# Vivado block design top_level, xcu55c-fsvh2892-2L-e, Vivado 2024.2
# (continued, part 2 of 3)
current_bd_instance /channel_1/packet_buffer/data_buffer/channel_0
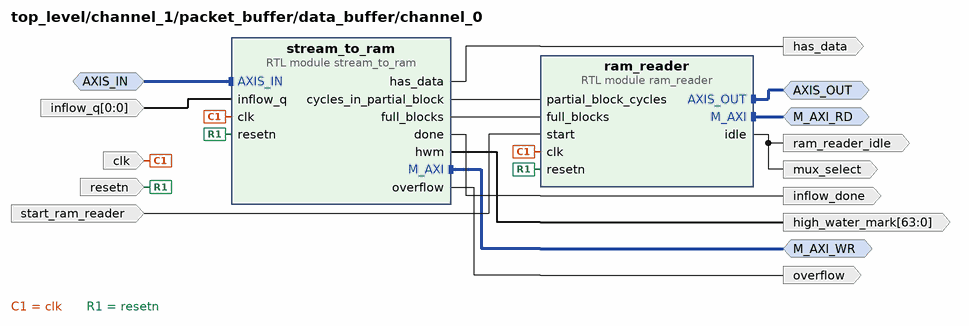
[diagram p24: block diagram inside /channel_1/packet_buffer/data_buffer/channel_0]
create_bd_intf_pin -mode Slave -vlnv xilinx.com:interface:axis_rtl:1.0 AXIS_IN
create_bd_intf_pin -mode Master -vlnv xilinx.com:interface:axis_rtl:1.0 AXIS_OUT
create_bd_intf_pin -mode Master -vlnv xilinx.com:interface:aximm_rtl:1.0 M_AXI_WR
create_bd_intf_pin -mode Master -vlnv xilinx.com:interface:aximm_rtl:1.0 M_AXI_RD
create_bd_pin -dir I -type clk clk
create_bd_pin -dir I resetn
create_bd_pin -dir I -from 0 -to 0 inflow_q
create_bd_pin -dir O ram_reader_idle
create_bd_pin -dir I start_ram_reader
create_bd_pin -dir O has_data
create_bd_pin -dir O inflow_done
create_bd_pin -dir O -from 63 -to 0 high_water_mark
create_bd_pin -dir O overflow
create_bd_pin -dir O mux_select

create_bd_cell -type module -reference stream_to_ram stream_to_ram
create_bd_cell -type module -reference ram_reader ram_reader

# ---- hierarchy /channel_1/packet_buffer/data_buffer/channel_1 ----
current_bd_instance /channel_1/packet_buffer/data_buffer/channel_1
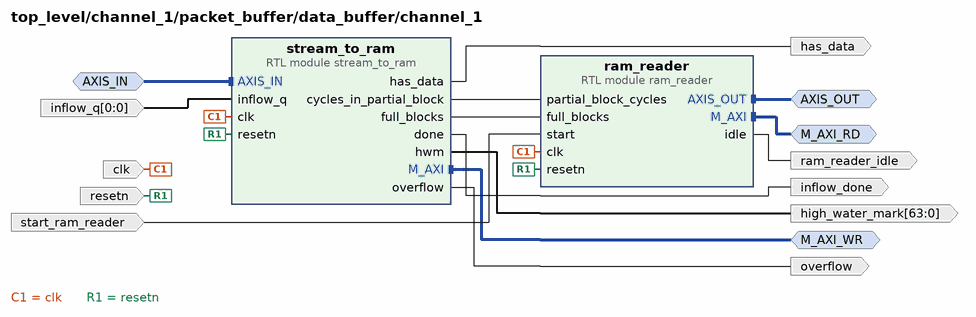
[diagram p25: block diagram inside /channel_1/packet_buffer/data_buffer/channel_1]
create_bd_intf_pin -mode Slave -vlnv xilinx.com:interface:axis_rtl:1.0 AXIS_IN
create_bd_intf_pin -mode Master -vlnv xilinx.com:interface:aximm_rtl:1.0 M_AXI_WR
create_bd_intf_pin -mode Master -vlnv xilinx.com:interface:axis_rtl:1.0 AXIS_OUT
create_bd_intf_pin -mode Master -vlnv xilinx.com:interface:aximm_rtl:1.0 M_AXI_RD
create_bd_pin -dir I -type clk clk
create_bd_pin -dir I resetn
create_bd_pin -dir I -from 0 -to 0 inflow_q
create_bd_pin -dir O has_data
create_bd_pin -dir O inflow_done
create_bd_pin -dir O -from 63 -to 0 high_water_mark
create_bd_pin -dir O overflow
create_bd_pin -dir O ram_reader_idle
create_bd_pin -dir I start_ram_reader

create_bd_cell -type module -reference stream_to_ram stream_to_ram
set_property -dict {CONFIG.CHANNEL 1} [get_bd_cells stream_to_ram]
create_bd_cell -type module -reference ram_reader ram_reader

# ---- hierarchy /channel_1/qsfp ----
current_bd_instance /channel_1/qsfp
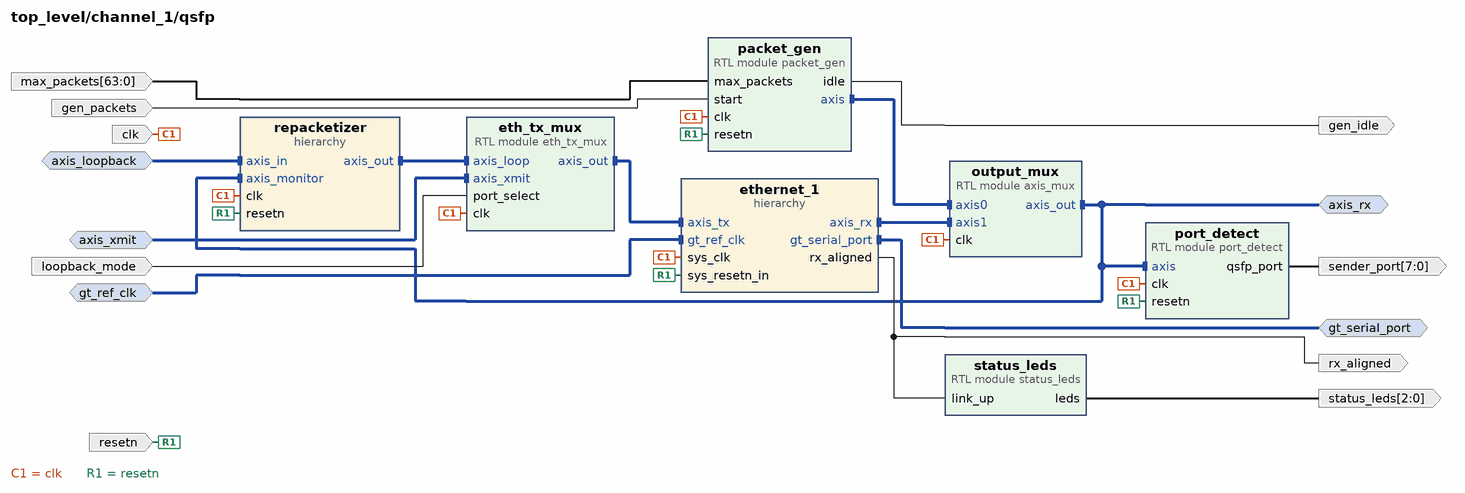
[diagram p26: block diagram inside /channel_1/qsfp]
create_bd_intf_pin -mode Master -vlnv xilinx.com:interface:axis_rtl:1.0 axis_rx
create_bd_intf_pin -mode Slave -vlnv xilinx.com:interface:diff_clock_rtl:1.0 gt_ref_clk
create_bd_intf_pin -mode Master -vlnv xilinx.com:interface:gt_rtl:1.0 gt_serial_port
create_bd_intf_pin -mode Slave -vlnv xilinx.com:interface:axis_rtl:1.0 axis_loopback
create_bd_intf_pin -mode Slave -vlnv xilinx.com:interface:axis_rtl:1.0 axis_xmit
create_bd_pin -dir I -type clk clk
create_bd_pin -dir I -type rst resetn
create_bd_pin -dir I gen_packets
create_bd_pin -dir I -from 63 -to 0 max_packets
create_bd_pin -dir O gen_idle
create_bd_pin -dir O rx_aligned
create_bd_pin -dir I loopback_mode
create_bd_pin -dir O -from 2 -to 0 status_leds
create_bd_pin -dir O -from 7 -to 0 sender_port

create_bd_cell -type hier ethernet_1
create_bd_cell -type hier repacketizer
create_bd_cell -type module -reference axis_mux output_mux
create_bd_cell -type module -reference eth_tx_mux eth_tx_mux
create_bd_cell -type module -reference packet_gen packet_gen
set_property -dict {CONFIG.SRC_MAC 1} [get_bd_cells packet_gen]
create_bd_cell -type module -reference status_leds status_leds
create_bd_cell -type module -reference port_detect port_detect

# ---- hierarchy /channel_1/qsfp/ethernet_1 ----
current_bd_instance /channel_1/qsfp/ethernet_1
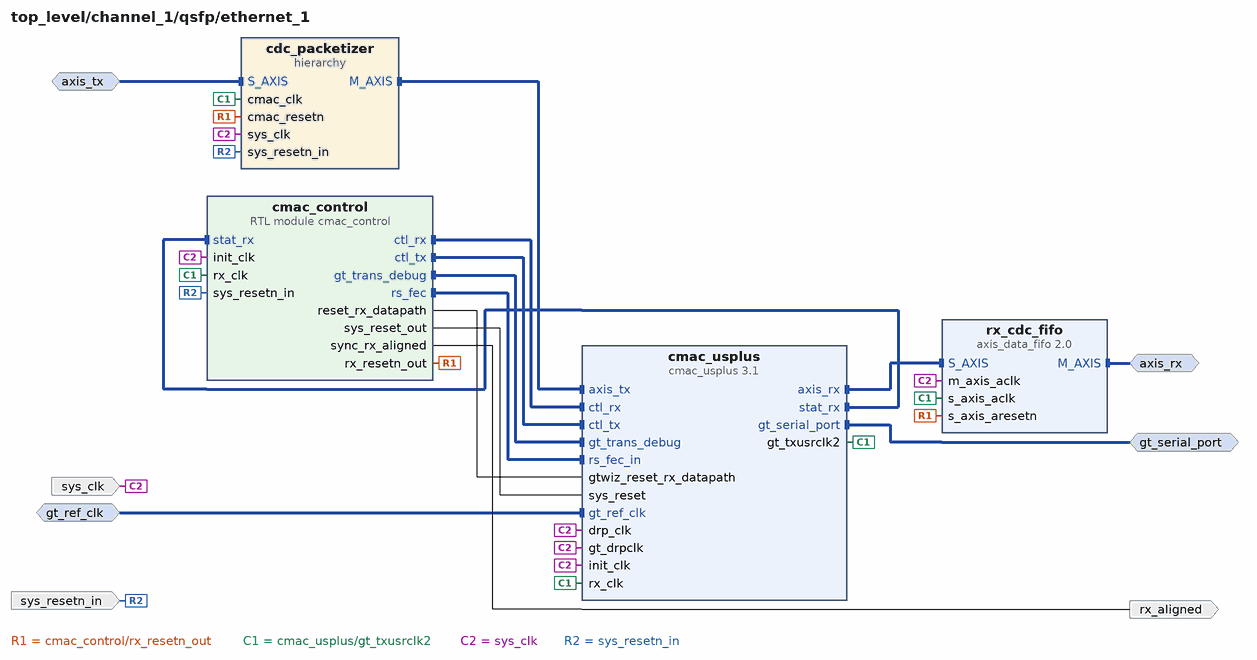
[diagram p27: block diagram inside /channel_1/qsfp/ethernet_1]
create_bd_intf_pin -mode Master -vlnv xilinx.com:interface:gt_rtl:1.0 gt_serial_port
create_bd_intf_pin -mode Slave -vlnv xilinx.com:interface:diff_clock_rtl:1.0 gt_ref_clk
create_bd_intf_pin -mode Master -vlnv xilinx.com:interface:axis_rtl:1.0 axis_rx
create_bd_intf_pin -mode Slave -vlnv xilinx.com:interface:axis_rtl:1.0 axis_tx
create_bd_pin -dir O rx_aligned
create_bd_pin -dir I sys_resetn_in
create_bd_pin -dir I sys_clk

create_bd_cell -type hier cdc_packetizer
create_bd_cell -type ip -vlnv xilinx.com:ip:axis_data_fifo:2.0 rx_cdc_fifo
set_property -dict {CONFIG.FIFO_DEPTH 16 CONFIG.IS_ACLK_ASYNC 1} [get_bd_cells rx_cdc_fifo]
create_bd_cell -type module -reference cmac_control cmac_control
create_bd_cell -type ip -vlnv xilinx.com:ip:cmac_usplus:3.1 cmac_usplus
set_property -dict [list \
  CONFIG.ADD_GT_CNRL_STS_PORTS 1 \
  CONFIG.CMAC_CAUI4_MODE 1 \
  CONFIG.CMAC_CORE_SELECT CMACE4_X0Y4 \
  CONFIG.GT_DRP_CLK 250 \
  CONFIG.GT_GROUP_SELECT {X0Y28~X0Y31} \
  CONFIG.GT_REF_CLK_FREQ 161.1328125 \
  CONFIG.INCLUDE_RS_FEC 1 \
  CONFIG.NUM_LANES 4x25 \
  CONFIG.RX_FLOW_CONTROL 0 \
  CONFIG.TX_FLOW_CONTROL 0 \
  CONFIG.USER_INTERFACE AXIS \
] [get_bd_cells cmac_usplus]

# ---- hierarchy /channel_1/qsfp/ethernet_1/cdc_packetizer ----
current_bd_instance /channel_1/qsfp/ethernet_1/cdc_packetizer
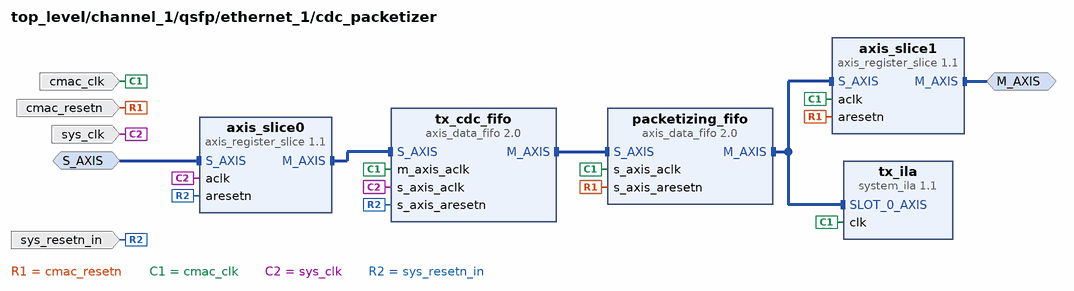
[diagram p28: block diagram inside /channel_1/qsfp/ethernet_1/cdc_packetizer]
create_bd_intf_pin -mode Slave -vlnv xilinx.com:interface:axis_rtl:1.0 S_AXIS
create_bd_intf_pin -mode Master -vlnv xilinx.com:interface:axis_rtl:1.0 M_AXIS
create_bd_pin -dir I sys_resetn_in
create_bd_pin -dir I sys_clk
create_bd_pin -dir I -type clk cmac_clk
create_bd_pin -dir I -type rst cmac_resetn

create_bd_cell -type ip -vlnv xilinx.com:ip:axis_data_fifo:2.0 tx_cdc_fifo
set_property -dict {CONFIG.FIFO_DEPTH 16 CONFIG.IS_ACLK_ASYNC 1} [get_bd_cells tx_cdc_fifo]
create_bd_cell -type ip -vlnv xilinx.com:ip:system_ila:1.1 tx_ila
set_property -dict {CONFIG.C_MON_TYPE INTERFACE CONFIG.C_SLOT_0_INTF_TYPE xilinx.com:interface:axis_rtl:1.0} [get_bd_cells tx_ila]
create_bd_cell -type ip -vlnv xilinx.com:ip:axis_data_fifo:2.0 packetizing_fifo
set_property -dict {CONFIG.FIFO_DEPTH 256 CONFIG.FIFO_MODE 2 CONFIG.IS_ACLK_ASYNC 0} [get_bd_cells packetizing_fifo]
create_bd_cell -type ip -vlnv xilinx.com:ip:axis_register_slice:1.1 axis_slice0
set_property -dict {CONFIG.REG_CONFIG 8} [get_bd_cells axis_slice0]
create_bd_cell -type ip -vlnv xilinx.com:ip:axis_register_slice:1.1 axis_slice1
set_property -dict {CONFIG.REG_CONFIG 8} [get_bd_cells axis_slice1]

# ---- hierarchy /channel_1/qsfp/repacketizer ----
current_bd_instance /channel_1/qsfp/repacketizer
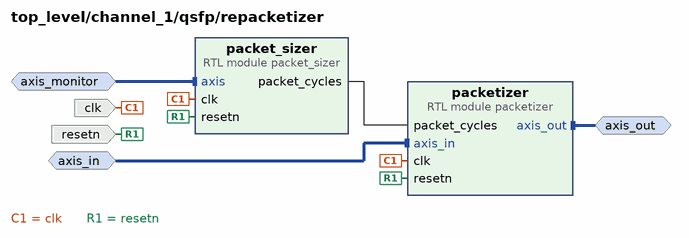
[diagram p29: block diagram inside /channel_1/qsfp/repacketizer]
create_bd_intf_pin -mode Monitor -vlnv xilinx.com:interface:axis_rtl:1.0 axis_monitor
create_bd_intf_pin -mode Slave -vlnv xilinx.com:interface:axis_rtl:1.0 axis_in
create_bd_intf_pin -mode Master -vlnv xilinx.com:interface:axis_rtl:1.0 axis_out
create_bd_pin -dir I -type clk clk
create_bd_pin -dir I -type rst resetn

create_bd_cell -type module -reference packet_sizer packet_sizer
create_bd_cell -type module -reference packetizer packetizer

# ---- connections ----

current_bd_instance /pcie0_bridge
connect_bd_intf_net [get_bd_intf_pins AXIS_RDMX] [get_bd_intf_pins axis_register_slice/S_AXIS]
connect_bd_intf_net [get_bd_intf_pins pcie_refclk] [get_bd_intf_pins bridge/pcie0_refclk]
connect_bd_intf_net [get_bd_intf_pins S_AXI_ABM] [get_bd_intf_pins axi_crossbar/S01_AXI]
connect_bd_intf_net [get_bd_intf_pins axi_crossbar/M00_AXI] [get_bd_intf_pins bridge/S_AXI_B]
connect_bd_intf_net [get_bd_intf_pins axi_crossbar/M00_AXI] [get_bd_intf_pins system_ila/SLOT_1_AXI]
connect_bd_intf_net [get_bd_intf_pins axis_register_slice/M_AXIS] [get_bd_intf_pins axis_throttle/axis_in]
connect_bd_intf_net [get_bd_intf_pins axis_throttle/axis_out] [get_bd_intf_pins rdmx_to_pci/AXIS_IN]
connect_bd_intf_net [get_bd_intf_pins axis_throttle/axis_out] [get_bd_intf_pins system_ila/SLOT_0_AXIS]
connect_bd_intf_net [get_bd_intf_pins M_AXI_B] [get_bd_intf_pins bridge/M_AXI_B]
connect_bd_intf_net [get_bd_intf_pins pcie_mgt] [get_bd_intf_pins bridge/pcie0_mgt]
connect_bd_intf_net [get_bd_intf_pins rdmx_to_pci/M_AXI] [get_bd_intf_pins axi_crossbar/S00_AXI]
connect_bd_net -net pause_1 [get_bd_pins pause_pci] [get_bd_pins axis_throttle/pause]
connect_bd_net [get_bd_pins pci_base] [get_bd_pins rdmx_to_pci/pci_base]
connect_bd_net [get_bd_pins pci_size] [get_bd_pins rdmx_to_pci/pci_size]
connect_bd_net -net pcie_bridge_axi_aclk [get_bd_pins bridge/axi_aclk] \
  [get_bd_pins axi_aclk] [get_bd_pins axis_throttle/clk] [get_bd_pins axis_register_slice/aclk] [get_bd_pins system_ila/clk] \
  [get_bd_pins axi_crossbar/aclk] [get_bd_pins rdmx_to_pci/axi_aclk]
connect_bd_net -net pcie_bridge_axi_aresetn [get_bd_pins bridge/axi_aresetn] [get_bd_pins axi_aresetn]
connect_bd_net -net rdmx_to_pci_pci_range_err [get_bd_pins rdmx_to_pci/pci_range_err_strb] [get_bd_pins pci_range_err_strb]
connect_bd_net [get_bd_pins rdmx_to_pci/pci_throughput] [get_bd_pins pci_throughput]
connect_bd_net [get_bd_pins resetn_in] \
  [get_bd_pins axis_register_slice/aresetn] [get_bd_pins axi_crossbar/aresetn] [get_bd_pins rdmx_to_pci/resetn_in]
connect_bd_net -net sys_rst_n_1 [get_bd_pins pcie_sys_rst_n] [get_bd_pins bridge/sys_rst_n]

current_bd_instance /pcie0_bridge/bridge
connect_bd_intf_net [get_bd_intf_pins pcie0_refclk] [get_bd_intf_pins util_ds_buf/CLK_IN_D]
connect_bd_intf_net [get_bd_intf_pins axi4_lite_plug/M_AXI] [get_bd_intf_pins pcie_bridge/S_AXI_LITE]
connect_bd_intf_net [get_bd_intf_pins S_AXI_B] [get_bd_intf_pins pcie_bridge/S_AXI_B]
connect_bd_intf_net [get_bd_intf_pins M_AXI_B] [get_bd_intf_pins pcie_bridge/M_AXI_B]
connect_bd_intf_net [get_bd_intf_pins pcie0_mgt] [get_bd_intf_pins pcie_bridge/pcie_mgt]
connect_bd_net [get_bd_pins pcie_bridge/axi_aclk] [get_bd_pins axi_aclk] [get_bd_pins axi4_lite_plug/clk]
connect_bd_net [get_bd_pins pcie_bridge/axi_aresetn] [get_bd_pins axi_aresetn]
connect_bd_net [get_bd_pins sys_rst_n] [get_bd_pins pcie_bridge/sys_rst_n]
connect_bd_net [get_bd_pins util_ds_buf/IBUF_DS_ODIV2] [get_bd_pins pcie_bridge/sys_clk]
connect_bd_net [get_bd_pins util_ds_buf/IBUF_OUT] [get_bd_pins pcie_bridge/sys_clk_gt]

current_bd_instance /pcie0_bridge/rdmx_to_pci
connect_bd_intf_net [get_bd_intf_pins M_AXI] [get_bd_intf_pins axi4_memfence/DST_AXI]
connect_bd_intf_net [get_bd_intf_pins AXIS_IN] [get_bd_intf_pins rdmx_to_pci/AXIS_IN]
connect_bd_intf_net [get_bd_intf_pins rdmx_to_pci/M_AXI] [get_bd_intf_pins axi4_memfence/SRC_AXI]
connect_bd_net [get_bd_pins pci_base] [get_bd_pins rdmx_to_pci/pci_base]
connect_bd_net [get_bd_pins pci_size] [get_bd_pins rdmx_to_pci/pci_size]
connect_bd_net -net pcie_bridge_axi_aclk [get_bd_pins axi_aclk] [get_bd_pins axi4_memfence/clk] [get_bd_pins rdmx_to_pci/clk]
connect_bd_net -net rdmx_to_pci_pci_range_err [get_bd_pins rdmx_to_pci/pci_range_err_strb] [get_bd_pins pci_range_err_strb]
connect_bd_net [get_bd_pins rdmx_to_pci/pci_throughput] [get_bd_pins pci_throughput]
connect_bd_net [get_bd_pins resetn_in] [get_bd_pins axi4_memfence/resetn] [get_bd_pins rdmx_to_pci/resetn]

current_bd_instance /system_interconnect
connect_bd_intf_net [get_bd_intf_pins S00_AXI] [get_bd_intf_pins system_interconnect/S00_AXI]
connect_bd_intf_net [get_bd_intf_pins M00_AXI] [get_bd_intf_pins system_interconnect/M00_AXI]
connect_bd_intf_net [get_bd_intf_pins M01_AXI] [get_bd_intf_pins system_interconnect/M01_AXI]
connect_bd_intf_net [get_bd_intf_pins axi_revision/S_AXI] [get_bd_intf_pins system_interconnect/M02_AXI]
connect_bd_net -net pcie_bridge_axi_aclk [get_bd_pins aclk] [get_bd_pins system_interconnect/aclk] [get_bd_pins axi_revision/AXI_ACLK]
connect_bd_net -net pcie_bridge_axi_aresetn [get_bd_pins aresetn] [get_bd_pins system_interconnect/aresetn] [get_bd_pins axi_revision/AXI_ARESETN]

current_bd_instance /channel_0
connect_bd_intf_net [get_bd_intf_pins axis_pcie_out] [get_bd_intf_pins packet_buffer/axis_pcie_out]
connect_bd_intf_net [get_bd_intf_pins axis_pcie_out] [get_bd_intf_pins control/seq_axis]
connect_bd_intf_net [get_bd_intf_pins packet_buffer/axis_in] [get_bd_intf_pins qsfp/axis_rx]
connect_bd_intf_net [get_bd_intf_pins SRC_AXI] [get_bd_intf_pins host_ram_to_rdmx/SRC_AXI]
connect_bd_intf_net [get_bd_intf_pins qsfp_clk] [get_bd_intf_pins qsfp/gt_ref_clk]
connect_bd_intf_net [get_bd_intf_pins hbm_refclk] [get_bd_intf_pins packet_buffer/hbm_refclk]
connect_bd_intf_net [get_bd_intf_pins packet_buffer/axis_qsfp_out] [get_bd_intf_pins qsfp/axis_loopback]
connect_bd_intf_net [get_bd_intf_pins qsfp_gt] [get_bd_intf_pins qsfp/gt_serial_port]
connect_bd_intf_net [get_bd_intf_pins host_ram_to_rdmx/AXIS_TX] [get_bd_intf_pins qsfp/axis_xmit]
connect_bd_intf_net [get_bd_intf_pins S_AXI] [get_bd_intf_pins control/S_AXI]
connect_bd_net -net abm_sender_idle [get_bd_pins host_ram_to_rdmx/idle] [get_bd_pins control/xmit_idle]
connect_bd_net -net byte_count_1 [get_bd_pins control/xmit_byte_count] [get_bd_pins host_ram_to_rdmx/byte_count]
connect_bd_net [get_bd_pins control/gen_packets] [get_bd_pins qsfp/gen_packets]
connect_bd_net [get_bd_pins control/loopback] [get_bd_pins packet_buffer/loopback_mode] [get_bd_pins qsfp/loopback_mode]
connect_bd_net [get_bd_pins control/packet_count] [get_bd_pins qsfp/max_packets]
connect_bd_net [get_bd_pins control/resetn_out] \
  [get_bd_pins resetn_out] [get_bd_pins packet_buffer/resetn] [get_bd_pins qsfp/resetn] [get_bd_pins host_ram_to_rdmx/resetn]
connect_bd_net -net dst_address_1 [get_bd_pins control/xmit_dst_addr] [get_bd_pins host_ram_to_rdmx/dst_address]
connect_bd_net [get_bd_pins packet_buffer/bad_packet_strb] [get_bd_pins control/bad_packet_strb]
connect_bd_net [get_bd_pins packet_buffer/good_packet_strb] [get_bd_pins control/good_packet_strb]
connect_bd_net [get_bd_pins packet_buffer/hbm_cattrip] [get_bd_pins hbm_cattrip] [get_bd_pins control/async_hbm_cattrip]
connect_bd_net [get_bd_pins packet_buffer/hbm_temp] [get_bd_pins control/async_hbm_temp]
connect_bd_net [get_bd_pins packet_buffer/hwm_0] [get_bd_pins control/hwm_0]
connect_bd_net [get_bd_pins packet_buffer/hwm_1] [get_bd_pins control/hwm_1]
connect_bd_net [get_bd_pins packet_buffer/overflow_0] [get_bd_pins control/overflow_0]
connect_bd_net [get_bd_pins packet_buffer/overflow_1] [get_bd_pins control/overflow_1]
connect_bd_net -net pause_pci_1 [get_bd_pins control/pause_pci] [get_bd_pins pause_pci]
connect_bd_net -net pci_base_1 [get_bd_pins control/pci_base] [get_bd_pins pci_base]
connect_bd_net -net pci_size_1 [get_bd_pins control/pci_size] [get_bd_pins pci_size]
connect_bd_net [get_bd_pins pci_throughput] [get_bd_pins control/pci_throughput]
connect_bd_net -net pcie_bridge_axi_aclk [get_bd_pins clk] \
  [get_bd_pins packet_buffer/clk] [get_bd_pins qsfp/clk] [get_bd_pins host_ram_to_rdmx/clk] [get_bd_pins control/clk]
connect_bd_net -net pcie_bridge_axi_aresetn [get_bd_pins resetn] [get_bd_pins control/resetn]
connect_bd_net -net pcie_bridge_pci_range_err_strb [get_bd_pins pci_range_err_strb] [get_bd_pins control/pci_range_err_strb]
connect_bd_net [get_bd_pins qsfp/gen_idle] [get_bd_pins control/generator_idle]
connect_bd_net [get_bd_pins qsfp/rx_aligned] [get_bd_pins control/async_pcs_aligned]
connect_bd_net [get_bd_pins qsfp/sender_port] [get_bd_pins control/sender_port]
connect_bd_net [get_bd_pins qsfp/status_leds] [get_bd_pins status_leds]
connect_bd_net -net src_address_1 [get_bd_pins control/xmit_src_addr] [get_bd_pins host_ram_to_rdmx/src_address]
connect_bd_net -net start_1 [get_bd_pins control/xmit_start] [get_bd_pins host_ram_to_rdmx/start]

current_bd_instance /channel_0/host_ram_to_rdmx
connect_bd_intf_net [get_bd_intf_pins rdmx_xmit/S_AXI] [get_bd_intf_pins dma_pci_to_rdmx/DST_AXI]
connect_bd_intf_net [get_bd_intf_pins SRC_AXI] [get_bd_intf_pins dma_pci_to_rdmx/SRC_AXI]
connect_bd_intf_net [get_bd_intf_pins AXIS_TX] [get_bd_intf_pins rdmx_xmit/AXIS_TX]
connect_bd_net [get_bd_pins byte_count] [get_bd_pins dma_pci_to_rdmx/byte_count]
connect_bd_net -net control_resetn_out1 [get_bd_pins resetn] [get_bd_pins rdmx_xmit/src_resetn] [get_bd_pins dma_pci_to_rdmx/resetn]
connect_bd_net [get_bd_pins dma_pci_to_rdmx/idle] [get_bd_pins idle]
connect_bd_net [get_bd_pins dst_address] [get_bd_pins dma_pci_to_rdmx/dst_address]
connect_bd_net -net pcie_bridge_axi_aclk [get_bd_pins clk] \
  [get_bd_pins rdmx_xmit/src_clk] [get_bd_pins rdmx_xmit/dst_clk] [get_bd_pins dma_pci_to_rdmx/clk]
connect_bd_net [get_bd_pins src_address] [get_bd_pins dma_pci_to_rdmx/src_address]
connect_bd_net [get_bd_pins start] [get_bd_pins dma_pci_to_rdmx/start]

current_bd_instance /channel_0/packet_buffer
connect_bd_intf_net [get_bd_intf_pins axis_pcie_out] [get_bd_intf_pins output_axis_switch/axis_out0]
connect_bd_intf_net [get_bd_intf_pins axis_in] [get_bd_intf_pins bad_packet_filter/AXIS_IN]
connect_bd_intf_net [get_bd_intf_pins data_buffer/AXIS_IN0] [get_bd_intf_pins input_axis_switch/axis_out0]
connect_bd_intf_net [get_bd_intf_pins data_buffer/AXIS_IN1] [get_bd_intf_pins input_axis_switch/axis_out1]
connect_bd_intf_net [get_bd_intf_pins input_axis_switch/axis_in] [get_bd_intf_pins bad_packet_filter/AXIS_OUT]
connect_bd_intf_net [get_bd_intf_pins output_axis_switch/axis_in] [get_bd_intf_pins data_buffer/axis_out]
connect_bd_intf_net [get_bd_intf_pins hbm_refclk] [get_bd_intf_pins data_buffer/hbm_refclk]
connect_bd_intf_net [get_bd_intf_pins axis_qsfp_out] [get_bd_intf_pins output_axis_switch/axis_out1]
connect_bd_net [get_bd_pins bad_packet_filter/bad_packet_strb] [get_bd_pins bad_packet_strb]
connect_bd_net -net channel_0_high_water_mark [get_bd_pins data_buffer/hwm_0] [get_bd_pins hwm_0]
connect_bd_net -net channel_0_overflow [get_bd_pins data_buffer/overflow_0] [get_bd_pins overflow_0]
connect_bd_net -net channel_0_ram_reader_idle [get_bd_pins data_buffer/ram_reader_idle0] [get_bd_pins switch_ctrl/ram_reader_idle0]
connect_bd_net -net channel_1_high_water_mark [get_bd_pins data_buffer/hwm_1] [get_bd_pins hwm_1]
connect_bd_net -net channel_1_idle [get_bd_pins data_buffer/ram_reader_idle1] [get_bd_pins switch_ctrl/ram_reader_idle1]
connect_bd_net -net channel_1_overflow [get_bd_pins data_buffer/overflow_1] [get_bd_pins overflow_1]
connect_bd_net [get_bd_pins input_axis_switch/packet_strb] [get_bd_pins good_packet_strb]
connect_bd_net -net pcie_bridge_axi_aclk [get_bd_pins clk] \
  [get_bd_pins input_axis_switch/clk] [get_bd_pins output_axis_switch/clk] [get_bd_pins switch_ctrl/clk] \
  [get_bd_pins data_buffer/clk] [get_bd_pins bad_packet_filter/clk]
connect_bd_net -net port_select_1 [get_bd_pins loopback_mode] [get_bd_pins output_axis_switch/port_select]
connect_bd_net -net ram_hbm_cattrip [get_bd_pins data_buffer/hbm_cattrip] [get_bd_pins hbm_cattrip]
connect_bd_net -net ram_hbm_temp [get_bd_pins data_buffer/hbm_temp] [get_bd_pins hbm_temp]
connect_bd_net [get_bd_pins resetn] [get_bd_pins switch_ctrl/resetn] [get_bd_pins data_buffer/resetn] [get_bd_pins bad_packet_filter/resetn]
connect_bd_net -net start_ram_reader_0 [get_bd_pins switch_ctrl/ram_reader_start0] [get_bd_pins data_buffer/start_ram_reader0]
connect_bd_net -net stream_to_ram_0_done [get_bd_pins data_buffer/inflow_done0] [get_bd_pins switch_ctrl/inflow_done0]
connect_bd_net -net stream_to_ram_0_has_data [get_bd_pins data_buffer/has_data0] [get_bd_pins switch_ctrl/has_data0]
connect_bd_net -net stream_to_ram_1_done [get_bd_pins data_buffer/inflow_done1] [get_bd_pins switch_ctrl/inflow_done1]
connect_bd_net -net stream_to_ram_1_has_data [get_bd_pins data_buffer/has_data1] [get_bd_pins switch_ctrl/has_data1]
connect_bd_net -net switch_ctrl_0_inflow_q [get_bd_pins switch_ctrl/inflow_q] \
  [get_bd_pins input_axis_switch/port_select] [get_bd_pins data_buffer/inflow_q]
connect_bd_net [get_bd_pins switch_ctrl/ram_reader_start1] [get_bd_pins data_buffer/start_ram_reader1]

current_bd_instance /channel_0/packet_buffer/data_buffer
connect_bd_intf_net [get_bd_intf_pins axis_out] [get_bd_intf_pins output_mux/axis_out]
connect_bd_intf_net [get_bd_intf_pins ram/AXI_RD0] [get_bd_intf_pins channel_0/M_AXI_RD]
connect_bd_intf_net [get_bd_intf_pins ram/AXI_RD1] [get_bd_intf_pins channel_1/M_AXI_RD]
connect_bd_intf_net [get_bd_intf_pins ram/AXI_WR0] [get_bd_intf_pins channel_0/M_AXI_WR]
connect_bd_intf_net [get_bd_intf_pins ram/AXI_WR1] [get_bd_intf_pins channel_1/M_AXI_WR]
connect_bd_intf_net [get_bd_intf_pins AXIS_IN0] [get_bd_intf_pins channel_0/AXIS_IN]
connect_bd_intf_net [get_bd_intf_pins AXIS_IN1] [get_bd_intf_pins channel_1/AXIS_IN]
connect_bd_intf_net [get_bd_intf_pins channel_0/AXIS_OUT] [get_bd_intf_pins output_mux/axis0]
connect_bd_intf_net [get_bd_intf_pins channel_1/AXIS_OUT] [get_bd_intf_pins output_mux/axis1]
connect_bd_intf_net [get_bd_intf_pins hbm_refclk] [get_bd_intf_pins ram/hbm_refclk]
connect_bd_net [get_bd_pins channel_0/high_water_mark] [get_bd_pins hwm_0]
connect_bd_net [get_bd_pins channel_0/mux_select] [get_bd_pins output_mux/input_select]
connect_bd_net [get_bd_pins channel_0/overflow] [get_bd_pins overflow_0]
connect_bd_net [get_bd_pins channel_0/ram_reader_idle] [get_bd_pins ram_reader_idle0]
connect_bd_net [get_bd_pins channel_1/high_water_mark] [get_bd_pins hwm_1]
connect_bd_net -net channel_1_idle [get_bd_pins channel_1/ram_reader_idle] [get_bd_pins ram_reader_idle1]
connect_bd_net [get_bd_pins channel_1/overflow] [get_bd_pins overflow_1]
connect_bd_net -net pcie_bridge_axi_aclk [get_bd_pins clk] \
  [get_bd_pins channel_1/clk] [get_bd_pins channel_0/clk] [get_bd_pins ram/aclk] [get_bd_pins ram/axi_nn_aclk] \
  [get_bd_pins output_mux/clk]
connect_bd_net [get_bd_pins ram/hbm_cattrip] [get_bd_pins hbm_cattrip]
connect_bd_net [get_bd_pins ram/hbm_temp] [get_bd_pins hbm_temp]
connect_bd_net [get_bd_pins resetn] \
  [get_bd_pins channel_1/resetn] [get_bd_pins channel_0/resetn] [get_bd_pins ram/aresetn] [get_bd_pins ram/axi_nn_resetn]
connect_bd_net [get_bd_pins start_ram_reader0] [get_bd_pins channel_0/start_ram_reader]
connect_bd_net -net stream_to_ram_0_done [get_bd_pins channel_0/inflow_done] [get_bd_pins inflow_done0]
connect_bd_net -net stream_to_ram_0_has_data [get_bd_pins channel_0/has_data] [get_bd_pins has_data0]
connect_bd_net -net stream_to_ram_1_done [get_bd_pins channel_1/inflow_done] [get_bd_pins inflow_done1]
connect_bd_net -net stream_to_ram_1_has_data [get_bd_pins channel_1/has_data] [get_bd_pins has_data1]
connect_bd_net -net switch_ctrl_0_inflow_q [get_bd_pins inflow_q] [get_bd_pins channel_1/inflow_q] [get_bd_pins channel_0/inflow_q]
connect_bd_net -net switch_ctrl_ram_reader_start1 [get_bd_pins start_ram_reader1] [get_bd_pins channel_1/start_ram_reader]

current_bd_instance /channel_0/packet_buffer/data_buffer/ram
connect_bd_intf_net [get_bd_intf_pins AXI_RD0] [get_bd_intf_pins axi4_breakout_0/S_RD]
connect_bd_intf_net [get_bd_intf_pins AXI_RD1] [get_bd_intf_pins axi4_breakout_1/S_RD]
connect_bd_intf_net [get_bd_intf_pins AXI_WR0] [get_bd_intf_pins axi4_breakout_0/S_WR]
connect_bd_intf_net [get_bd_intf_pins AXI_WR1] [get_bd_intf_pins axi4_breakout_1/S_WR]
connect_bd_intf_net [get_bd_intf_pins axi4_breakout_0/M_AXI] [get_bd_intf_pins bank0_splitter/S_AXI]
connect_bd_intf_net [get_bd_intf_pins axi4_breakout_1/M_AXI] [get_bd_intf_pins bank1_splitter/S_AXI]
connect_bd_intf_net [get_bd_intf_pins bank0_splitter/M0_AXI] [get_bd_intf_pins smartconnect_0/S00_AXI]
connect_bd_intf_net [get_bd_intf_pins bank0_splitter/M1_AXI] [get_bd_intf_pins smartconnect_1/S00_AXI]
connect_bd_intf_net [get_bd_intf_pins bank1_splitter/M0_AXI] [get_bd_intf_pins smartconnect_2/S00_AXI]
connect_bd_intf_net [get_bd_intf_pins bank1_splitter/M1_AXI] [get_bd_intf_pins smartconnect_3/S00_AXI]
connect_bd_intf_net [get_bd_intf_pins hbm_refclk] [get_bd_intf_pins clock_buffer/CLK_IN_D]
connect_bd_intf_net [get_bd_intf_pins smartconnect_0/M00_AXI] [get_bd_intf_pins hbm_0/SAXI_00_8HI]
connect_bd_intf_net [get_bd_intf_pins smartconnect_0/M01_AXI] [get_bd_intf_pins hbm_0/SAXI_01_8HI]
connect_bd_intf_net [get_bd_intf_pins smartconnect_0/M02_AXI] [get_bd_intf_pins hbm_0/SAXI_02_8HI]
connect_bd_intf_net [get_bd_intf_pins smartconnect_0/M03_AXI] [get_bd_intf_pins hbm_0/SAXI_03_8HI]
connect_bd_intf_net [get_bd_intf_pins smartconnect_1/M00_AXI] [get_bd_intf_pins hbm_0/SAXI_04_8HI]
connect_bd_intf_net [get_bd_intf_pins smartconnect_1/M01_AXI] [get_bd_intf_pins hbm_0/SAXI_05_8HI]
connect_bd_intf_net [get_bd_intf_pins smartconnect_1/M02_AXI] [get_bd_intf_pins hbm_0/SAXI_06_8HI]
connect_bd_intf_net [get_bd_intf_pins smartconnect_1/M03_AXI] [get_bd_intf_pins hbm_0/SAXI_07_8HI]
connect_bd_intf_net [get_bd_intf_pins smartconnect_2/M00_AXI] [get_bd_intf_pins hbm_0/SAXI_08_8HI]
connect_bd_intf_net [get_bd_intf_pins smartconnect_2/M01_AXI] [get_bd_intf_pins hbm_0/SAXI_09_8HI]
connect_bd_intf_net [get_bd_intf_pins smartconnect_2/M02_AXI] [get_bd_intf_pins hbm_0/SAXI_10_8HI]
connect_bd_intf_net [get_bd_intf_pins smartconnect_2/M03_AXI] [get_bd_intf_pins hbm_0/SAXI_11_8HI]
connect_bd_intf_net [get_bd_intf_pins smartconnect_3/M00_AXI] [get_bd_intf_pins hbm_0/SAXI_12_8HI]
connect_bd_intf_net [get_bd_intf_pins smartconnect_3/M01_AXI] [get_bd_intf_pins hbm_0/SAXI_13_8HI]
connect_bd_intf_net [get_bd_intf_pins smartconnect_3/M02_AXI] [get_bd_intf_pins hbm_0/SAXI_14_8HI]
connect_bd_intf_net [get_bd_intf_pins smartconnect_3/M03_AXI] [get_bd_intf_pins hbm_0/SAXI_15_8HI]
connect_bd_net [get_bd_pins aclk] \
  [get_bd_pins axi4_breakout_0/clk] [get_bd_pins axi4_breakout_1/clk] [get_bd_pins smartconnect_0/aclk] \
  [get_bd_pins smartconnect_1/aclk] [get_bd_pins smartconnect_2/aclk] [get_bd_pins smartconnect_3/aclk] \
  [get_bd_pins bank0_splitter/clk] [get_bd_pins bank1_splitter/clk]
connect_bd_net [get_bd_pins aresetn] \
  [get_bd_pins smartconnect_0/aresetn] [get_bd_pins smartconnect_1/aresetn] [get_bd_pins smartconnect_2/aresetn] \
  [get_bd_pins smartconnect_3/aresetn] [get_bd_pins bank0_splitter/resetn] [get_bd_pins bank1_splitter/resetn]
connect_bd_net -net clk_1 [get_bd_pins axi_nn_aclk] \
  [get_bd_pins hbm_0/AXI_00_ACLK] [get_bd_pins hbm_0/AXI_01_ACLK] [get_bd_pins hbm_0/AXI_02_ACLK] \
  [get_bd_pins hbm_0/AXI_03_ACLK] [get_bd_pins hbm_0/AXI_04_ACLK] [get_bd_pins hbm_0/AXI_05_ACLK] \
  [get_bd_pins hbm_0/AXI_06_ACLK] [get_bd_pins hbm_0/AXI_07_ACLK] [get_bd_pins hbm_0/AXI_08_ACLK] \
  [get_bd_pins hbm_0/AXI_09_ACLK] [get_bd_pins hbm_0/AXI_10_ACLK] [get_bd_pins hbm_0/AXI_11_ACLK] \
  [get_bd_pins hbm_0/AXI_12_ACLK] [get_bd_pins hbm_0/AXI_13_ACLK] [get_bd_pins hbm_0/AXI_14_ACLK] \
  [get_bd_pins hbm_0/AXI_15_ACLK]
connect_bd_net [get_bd_pins hbm_0/DRAM_0_STAT_CATTRIP] [get_bd_pins hbm_cattrip]
connect_bd_net [get_bd_pins hbm_0/DRAM_0_STAT_TEMP] [get_bd_pins hbm_temp]
connect_bd_net -net resetn_1 [get_bd_pins axi_nn_resetn] \
  [get_bd_pins hbm_0/AXI_00_ARESET_N] [get_bd_pins hbm_0/AXI_01_ARESET_N] [get_bd_pins hbm_0/AXI_02_ARESET_N] \
  [get_bd_pins hbm_0/AXI_03_ARESET_N] [get_bd_pins hbm_0/AXI_04_ARESET_N] [get_bd_pins hbm_0/AXI_05_ARESET_N] \
  [get_bd_pins hbm_0/AXI_06_ARESET_N] [get_bd_pins hbm_0/AXI_07_ARESET_N] [get_bd_pins hbm_0/AXI_08_ARESET_N] \
  [get_bd_pins hbm_0/AXI_09_ARESET_N] [get_bd_pins hbm_0/AXI_10_ARESET_N] [get_bd_pins hbm_0/AXI_11_ARESET_N] \
  [get_bd_pins hbm_0/AXI_12_ARESET_N] [get_bd_pins hbm_0/AXI_13_ARESET_N] [get_bd_pins hbm_0/AXI_14_ARESET_N] \
  [get_bd_pins hbm_0/AXI_15_ARESET_N]
connect_bd_net -net util_ds_buf_0_IBUF_OUT [get_bd_pins clock_buffer/IBUF_OUT] [get_bd_pins hbm_0/HBM_REF_CLK_0] [get_bd_pins hbm_0/APB_0_PCLK]
connect_bd_net -net xlconstant_0_dout [get_bd_pins one/dout] [get_bd_pins hbm_0/APB_0_PRESET_N]

current_bd_instance /channel_0/packet_buffer/data_buffer/channel_0
connect_bd_intf_net [get_bd_intf_pins M_AXI_WR] [get_bd_intf_pins stream_to_ram/M_AXI]
connect_bd_intf_net [get_bd_intf_pins M_AXI_RD] [get_bd_intf_pins ram_reader/M_AXI]
connect_bd_intf_net [get_bd_intf_pins AXIS_IN] [get_bd_intf_pins stream_to_ram/AXIS_IN]
connect_bd_intf_net [get_bd_intf_pins AXIS_OUT] [get_bd_intf_pins ram_reader/AXIS_OUT]
connect_bd_net -net pcie_bridge_axi_aclk [get_bd_pins clk] [get_bd_pins ram_reader/clk] [get_bd_pins stream_to_ram/clk]
connect_bd_net [get_bd_pins ram_reader/idle] [get_bd_pins ram_reader_idle] [get_bd_pins mux_select]
connect_bd_net [get_bd_pins resetn] [get_bd_pins ram_reader/resetn] [get_bd_pins stream_to_ram/resetn]
connect_bd_net [get_bd_pins start_ram_reader] [get_bd_pins ram_reader/start]
connect_bd_net [get_bd_pins stream_to_ram/cycles_in_partial_block] [get_bd_pins ram_reader/partial_block_cycles]
connect_bd_net [get_bd_pins stream_to_ram/done] [get_bd_pins inflow_done]
connect_bd_net [get_bd_pins stream_to_ram/full_blocks] [get_bd_pins ram_reader/full_blocks]
connect_bd_net [get_bd_pins stream_to_ram/has_data] [get_bd_pins has_data]
connect_bd_net [get_bd_pins stream_to_ram/hwm] [get_bd_pins high_water_mark]
connect_bd_net [get_bd_pins stream_to_ram/overflow] [get_bd_pins overflow]
connect_bd_net -net switch_ctrl_0_inflow_q [get_bd_pins inflow_q] [get_bd_pins stream_to_ram/inflow_q]

current_bd_instance /channel_0/packet_buffer/data_buffer/channel_1
connect_bd_intf_net [get_bd_intf_pins M_AXI_WR] [get_bd_intf_pins stream_to_ram/M_AXI]
connect_bd_intf_net [get_bd_intf_pins AXIS_OUT] [get_bd_intf_pins ram_reader/AXIS_OUT]
connect_bd_intf_net [get_bd_intf_pins M_AXI_RD] [get_bd_intf_pins ram_reader/M_AXI]
connect_bd_intf_net [get_bd_intf_pins AXIS_IN] [get_bd_intf_pins stream_to_ram/AXIS_IN]
connect_bd_net -net pcie_bridge_axi_aclk [get_bd_pins clk] [get_bd_pins ram_reader/clk] [get_bd_pins stream_to_ram/clk]
connect_bd_net [get_bd_pins ram_reader/idle] [get_bd_pins ram_reader_idle]
connect_bd_net [get_bd_pins resetn] [get_bd_pins ram_reader/resetn] [get_bd_pins stream_to_ram/resetn]
connect_bd_net -net start_1 [get_bd_pins start_ram_reader] [get_bd_pins ram_reader/start]
connect_bd_net [get_bd_pins stream_to_ram/cycles_in_partial_block] [get_bd_pins ram_reader/partial_block_cycles]
connect_bd_net [get_bd_pins stream_to_ram/done] [get_bd_pins inflow_done]
connect_bd_net [get_bd_pins stream_to_ram/full_blocks] [get_bd_pins ram_reader/full_blocks]
connect_bd_net [get_bd_pins stream_to_ram/has_data] [get_bd_pins has_data]
connect_bd_net [get_bd_pins stream_to_ram/hwm] [get_bd_pins high_water_mark]
connect_bd_net [get_bd_pins stream_to_ram/overflow] [get_bd_pins overflow]
connect_bd_net -net switch_ctrl_0_inflow_q [get_bd_pins inflow_q] [get_bd_pins stream_to_ram/inflow_q]

current_bd_instance /channel_0/qsfp
connect_bd_intf_net [get_bd_intf_pins gt_ref_clk] [get_bd_intf_pins ethernet_0/gt_ref_clk]
connect_bd_intf_net [get_bd_intf_pins gt_serial_port] [get_bd_intf_pins ethernet_0/gt_serial_port]
connect_bd_intf_net [get_bd_intf_pins axis_rx] [get_bd_intf_pins output_mux/axis_out]
connect_bd_intf_net [get_bd_intf_pins axis_rx] [get_bd_intf_pins repacketizer/axis_monitor]
connect_bd_intf_net [get_bd_intf_pins axis_rx] [get_bd_intf_pins port_detect/axis]
connect_bd_intf_net [get_bd_intf_pins axis_loopback] [get_bd_intf_pins repacketizer/axis_in]
connect_bd_intf_net [get_bd_intf_pins eth_tx_mux/axis_out] [get_bd_intf_pins ethernet_0/axis_tx]
connect_bd_intf_net [get_bd_intf_pins ethernet_0/axis_rx] [get_bd_intf_pins output_mux/axis1]
connect_bd_intf_net [get_bd_intf_pins packet_gen/axis] [get_bd_intf_pins output_mux/axis0]
connect_bd_intf_net [get_bd_intf_pins repacketizer/axis_out] [get_bd_intf_pins eth_tx_mux/axis_loop]
connect_bd_intf_net [get_bd_intf_pins axis_xmit] [get_bd_intf_pins eth_tx_mux/axis_xmit]
connect_bd_net -net ethernet_rx_aligned [get_bd_pins ethernet_0/rx_aligned] [get_bd_pins rx_aligned] [get_bd_pins status_leds/link_up]
connect_bd_net [get_bd_pins max_packets] [get_bd_pins packet_gen/max_packets]
connect_bd_net [get_bd_pins packet_gen/idle] [get_bd_pins gen_idle]
connect_bd_net -net pcie_bridge_axi_aclk [get_bd_pins clk] \
  [get_bd_pins ethernet_0/sys_clk] [get_bd_pins repacketizer/clk] [get_bd_pins output_mux/clk] [get_bd_pins eth_tx_mux/clk] \
  [get_bd_pins packet_gen/clk] [get_bd_pins port_detect/clk]
connect_bd_net -net pcie_bridge_axi_aresetn [get_bd_pins resetn] \
  [get_bd_pins ethernet_0/sys_resetn_in] [get_bd_pins repacketizer/resetn] [get_bd_pins packet_gen/resetn] \
  [get_bd_pins port_detect/resetn]
connect_bd_net -net port_detect_0_qsfp_port [get_bd_pins port_detect/qsfp_port] [get_bd_pins sender_port]
connect_bd_net -net port_select_1 [get_bd_pins loopback_mode] [get_bd_pins eth_tx_mux/port_select]
connect_bd_net -net start_1 [get_bd_pins gen_packets] [get_bd_pins packet_gen/start]
connect_bd_net [get_bd_pins status_leds/leds] [get_bd_pins status_leds]

current_bd_instance /channel_0/qsfp/ethernet_0
connect_bd_intf_net [get_bd_intf_pins axis_tx] [get_bd_intf_pins cdc_packetizer/S_AXIS]
connect_bd_intf_net [get_bd_intf_pins axis_rx] [get_bd_intf_pins rx_cdc_fifo/M_AXIS]
connect_bd_intf_net [get_bd_intf_pins cmac_control/ctl_rx] [get_bd_intf_pins cmac_usplus/ctl_rx]
connect_bd_intf_net [get_bd_intf_pins cmac_control/ctl_tx] [get_bd_intf_pins cmac_usplus/ctl_tx]
connect_bd_intf_net [get_bd_intf_pins cmac_control/gt_trans_debug] [get_bd_intf_pins cmac_usplus/gt_trans_debug]
connect_bd_intf_net [get_bd_intf_pins cmac_control/rs_fec] [get_bd_intf_pins cmac_usplus/rs_fec_in]
connect_bd_intf_net [get_bd_intf_pins rx_cdc_fifo/S_AXIS] [get_bd_intf_pins cmac_usplus/axis_rx]
connect_bd_intf_net [get_bd_intf_pins gt_serial_port] [get_bd_intf_pins cmac_usplus/gt_serial_port]
connect_bd_intf_net [get_bd_intf_pins cmac_usplus/stat_rx] [get_bd_intf_pins cmac_control/stat_rx]
connect_bd_intf_net [get_bd_intf_pins gt_ref_clk] [get_bd_intf_pins cmac_usplus/gt_ref_clk]
connect_bd_intf_net [get_bd_intf_pins cdc_packetizer/M_AXIS] [get_bd_intf_pins cmac_usplus/axis_tx]
connect_bd_net [get_bd_pins cmac_control/reset_rx_datapath] [get_bd_pins cmac_usplus/gtwiz_reset_rx_datapath]
connect_bd_net [get_bd_pins cmac_control/rx_resetn_out] [get_bd_pins cdc_packetizer/cmac_resetn] [get_bd_pins rx_cdc_fifo/s_axis_aresetn]
connect_bd_net [get_bd_pins cmac_control/sync_rx_aligned] [get_bd_pins rx_aligned]
connect_bd_net [get_bd_pins cmac_control/sys_reset_out] [get_bd_pins cmac_usplus/sys_reset]
connect_bd_net [get_bd_pins cmac_usplus/gt_txusrclk2] \
  [get_bd_pins cdc_packetizer/cmac_clk] [get_bd_pins rx_cdc_fifo/s_axis_aclk] [get_bd_pins cmac_usplus/rx_clk] \
  [get_bd_pins cmac_control/rx_clk]
connect_bd_net [get_bd_pins sys_clk] \
  [get_bd_pins cdc_packetizer/sys_clk] [get_bd_pins rx_cdc_fifo/m_axis_aclk] [get_bd_pins cmac_usplus/gt_drpclk] \
  [get_bd_pins cmac_usplus/init_clk] [get_bd_pins cmac_usplus/drp_clk] [get_bd_pins cmac_control/init_clk]
connect_bd_net [get_bd_pins sys_resetn_in] [get_bd_pins cdc_packetizer/sys_resetn_in] [get_bd_pins cmac_control/sys_resetn_in]

current_bd_instance /channel_0/qsfp/ethernet_0/cdc_packetizer
connect_bd_intf_net [get_bd_intf_pins S_AXIS] [get_bd_intf_pins axis_slice0/S_AXIS]
connect_bd_intf_net [get_bd_intf_pins axis_slice0/M_AXIS] [get_bd_intf_pins tx_cdc_fifo/S_AXIS]
connect_bd_intf_net [get_bd_intf_pins M_AXIS] [get_bd_intf_pins axis_slice1/M_AXIS]
connect_bd_intf_net [get_bd_intf_pins packetizing_fifo/M_AXIS] [get_bd_intf_pins axis_slice1/S_AXIS]
connect_bd_intf_net [get_bd_intf_pins packetizing_fifo/M_AXIS] [get_bd_intf_pins tx_ila/SLOT_0_AXIS]
connect_bd_intf_net [get_bd_intf_pins tx_cdc_fifo/M_AXIS] [get_bd_intf_pins packetizing_fifo/S_AXIS]
connect_bd_net -net cmac_control_rx_resetn_out [get_bd_pins cmac_resetn] \
  [get_bd_pins axis_slice1/aresetn] [get_bd_pins packetizing_fifo/s_axis_aresetn]
connect_bd_net -net cmac_usplus_gt_txusrclk2 [get_bd_pins cmac_clk] \
  [get_bd_pins axis_slice1/aclk] [get_bd_pins tx_cdc_fifo/m_axis_aclk] [get_bd_pins tx_ila/clk] \
  [get_bd_pins packetizing_fifo/s_axis_aclk]
connect_bd_net [get_bd_pins sys_clk] [get_bd_pins axis_slice0/aclk] [get_bd_pins tx_cdc_fifo/s_axis_aclk]
connect_bd_net [get_bd_pins sys_resetn_in] [get_bd_pins axis_slice0/aresetn] [get_bd_pins tx_cdc_fifo/s_axis_aresetn]

current_bd_instance /channel_0/qsfp/repacketizer
connect_bd_intf_net [get_bd_intf_pins axis_monitor] [get_bd_intf_pins packet_sizer/axis]
connect_bd_intf_net [get_bd_intf_pins axis_in] [get_bd_intf_pins packetizer/axis_in]
connect_bd_intf_net [get_bd_intf_pins axis_out] [get_bd_intf_pins packetizer/axis_out]
connect_bd_net [get_bd_pins packet_sizer/packet_cycles] [get_bd_pins packetizer/packet_cycles]
connect_bd_net -net pcie_bridge_axi_aclk [get_bd_pins clk] [get_bd_pins packet_sizer/clk] [get_bd_pins packetizer/clk]
connect_bd_net -net pcie_bridge_axi_aresetn [get_bd_pins resetn] [get_bd_pins packet_sizer/resetn] [get_bd_pins packetizer/resetn]

current_bd_instance /pcie1_bridge
connect_bd_intf_net [get_bd_intf_pins AXIS_RDMX] [get_bd_intf_pins axis_register_slice/S_AXIS]
connect_bd_intf_net [get_bd_intf_pins S_AXI_ABM] [get_bd_intf_pins axi_crossbar/S01_AXI]
connect_bd_intf_net [get_bd_intf_pins axi_crossbar/M00_AXI] [get_bd_intf_pins bridge/S_AXI]
connect_bd_intf_net [get_bd_intf_pins axi_crossbar/M00_AXI] [get_bd_intf_pins system_ila/SLOT_1_AXI]
connect_bd_intf_net [get_bd_intf_pins axis_register_slice/M_AXIS] [get_bd_intf_pins axis_throttle/axis_in]
connect_bd_intf_net [get_bd_intf_pins axis_throttle/axis_out] [get_bd_intf_pins rdmx_to_pci/AXIS_IN]
connect_bd_intf_net [get_bd_intf_pins axis_throttle/axis_out] [get_bd_intf_pins system_ila/SLOT_0_AXIS]
connect_bd_intf_net [get_bd_intf_pins pcie_mgt] [get_bd_intf_pins bridge/pcie_mgt]
connect_bd_intf_net [get_bd_intf_pins pcie_refclk] [get_bd_intf_pins bridge/pcie_refclk]
connect_bd_intf_net [get_bd_intf_pins rdmx_to_pci/M_AXI] [get_bd_intf_pins axi_crossbar/S00_AXI]
connect_bd_net -net pause_1 [get_bd_pins pause_pci] [get_bd_pins axis_throttle/pause]
connect_bd_net [get_bd_pins pci_base] [get_bd_pins rdmx_to_pci/pci_base]
connect_bd_net [get_bd_pins pci_size] [get_bd_pins rdmx_to_pci/pci_size]
connect_bd_net -net pcie_bridge_axi_aclk [get_bd_pins sys_clk] \
  [get_bd_pins axis_throttle/clk] [get_bd_pins bridge/sys_clk] [get_bd_pins axis_register_slice/aclk] \
  [get_bd_pins system_ila/clk] [get_bd_pins axi_crossbar/aclk] [get_bd_pins rdmx_to_pci/sys_clk]
connect_bd_net -net rdmx_to_pci_pci_range_err [get_bd_pins rdmx_to_pci/pci_range_err_strb] [get_bd_pins pci_range_err_strb]
connect_bd_net [get_bd_pins rdmx_to_pci/pci_throughput] [get_bd_pins pci_throughput]
connect_bd_net [get_bd_pins resetn_in] \
  [get_bd_pins bridge/resetn_in] [get_bd_pins axis_register_slice/aresetn] [get_bd_pins axi_crossbar/aresetn] \
  [get_bd_pins rdmx_to_pci/resetn_in]
connect_bd_net -net sys_rst_n_1 [get_bd_pins pcie_sys_rst_n] [get_bd_pins bridge/sys_rst_n]

current_bd_instance /pcie1_bridge/bridge
connect_bd_intf_net [get_bd_intf_pins pcie_refclk] [get_bd_intf_pins util_ds_buf/CLK_IN_D]
connect_bd_intf_net [get_bd_intf_pins axi4_lite_plug/M_AXI] [get_bd_intf_pins pcie_bridge/S_AXI_LITE]
connect_bd_intf_net [get_bd_intf_pins axi_clock_converter/M_AXI] [get_bd_intf_pins pcie_bridge/S_AXI_B]
connect_bd_intf_net [get_bd_intf_pins S_AXI] [get_bd_intf_pins axi_clock_converter/S_AXI]
connect_bd_intf_net [get_bd_intf_pins pcie_mgt] [get_bd_intf_pins pcie_bridge/pcie_mgt]
connect_bd_net -net pcie_bridge_axi_aclk [get_bd_pins sys_clk] [get_bd_pins axi_clock_converter/s_axi_aclk]
connect_bd_net [get_bd_pins pcie_bridge/axi_aclk] [get_bd_pins axi_clock_converter/m_axi_aclk] [get_bd_pins axi4_lite_plug/clk]
connect_bd_net [get_bd_pins pcie_bridge/axi_aresetn] [get_bd_pins axi_clock_converter/m_axi_aresetn]
connect_bd_net [get_bd_pins resetn_in] [get_bd_pins axi_clock_converter/s_axi_aresetn]
connect_bd_net [get_bd_pins sys_rst_n] [get_bd_pins pcie_bridge/sys_rst_n]
connect_bd_net [get_bd_pins util_ds_buf/IBUF_DS_ODIV2] [get_bd_pins pcie_bridge/sys_clk]
connect_bd_net [get_bd_pins util_ds_buf/IBUF_OUT] [get_bd_pins pcie_bridge/sys_clk_gt]

current_bd_instance /pcie1_bridge/rdmx_to_pci
connect_bd_intf_net [get_bd_intf_pins M_AXI] [get_bd_intf_pins axi4_memfence/DST_AXI]
connect_bd_intf_net [get_bd_intf_pins AXIS_IN] [get_bd_intf_pins rdmx_to_pci/AXIS_IN]
connect_bd_intf_net [get_bd_intf_pins axi4_memfence/SRC_AXI] [get_bd_intf_pins rdmx_to_pci/M_AXI]
connect_bd_net [get_bd_pins pci_base] [get_bd_pins rdmx_to_pci/pci_base]
connect_bd_net [get_bd_pins pci_size] [get_bd_pins rdmx_to_pci/pci_size]
connect_bd_net -net pcie_bridge_axi_aclk [get_bd_pins sys_clk] [get_bd_pins axi4_memfence/clk] [get_bd_pins rdmx_to_pci/clk]
connect_bd_net -net rdmx_to_pci_pci_range_err [get_bd_pins rdmx_to_pci/pci_range_err_strb] [get_bd_pins pci_range_err_strb]
connect_bd_net [get_bd_pins rdmx_to_pci/pci_throughput] [get_bd_pins pci_throughput]
connect_bd_net [get_bd_pins resetn_in] [get_bd_pins axi4_memfence/resetn] [get_bd_pins rdmx_to_pci/resetn]

current_bd_instance /channel_1
connect_bd_intf_net [get_bd_intf_pins axis_pcie_out] [get_bd_intf_pins packet_buffer/axis_pcie_out]
connect_bd_intf_net [get_bd_intf_pins axis_pcie_out] [get_bd_intf_pins control/seq_axis]
connect_bd_intf_net [get_bd_intf_pins packet_buffer/axis_in] [get_bd_intf_pins qsfp/axis_rx]
connect_bd_intf_net [get_bd_intf_pins SRC_AXI] [get_bd_intf_pins host_ram_to_rdmx/SRC_AXI]
connect_bd_intf_net [get_bd_intf_pins qsfp_clk] [get_bd_intf_pins qsfp/gt_ref_clk]
connect_bd_intf_net [get_bd_intf_pins hbm_refclk] [get_bd_intf_pins packet_buffer/hbm_refclk]
connect_bd_intf_net [get_bd_intf_pins packet_buffer/axis_qsfp_out] [get_bd_intf_pins qsfp/axis_loopback]
connect_bd_intf_net [get_bd_intf_pins qsfp_gt] [get_bd_intf_pins qsfp/gt_serial_port]
connect_bd_intf_net [get_bd_intf_pins host_ram_to_rdmx/AXIS_TX] [get_bd_intf_pins qsfp/axis_xmit]
connect_bd_intf_net [get_bd_intf_pins S_AXI] [get_bd_intf_pins control/S_AXI]
connect_bd_net -net abm_sender_idle [get_bd_pins host_ram_to_rdmx/idle] [get_bd_pins control/xmit_idle]
connect_bd_net -net byte_count_1 [get_bd_pins control/xmit_byte_count] [get_bd_pins host_ram_to_rdmx/byte_count]
connect_bd_net [get_bd_pins control/gen_packets] [get_bd_pins qsfp/gen_packets]
connect_bd_net [get_bd_pins control/loopback] [get_bd_pins packet_buffer/loopback_mode] [get_bd_pins qsfp/loopback_mode]
connect_bd_net [get_bd_pins control/packet_count] [get_bd_pins qsfp/max_packets]
connect_bd_net [get_bd_pins control/resetn_out] \
  [get_bd_pins resetn_out] [get_bd_pins packet_buffer/resetn] [get_bd_pins qsfp/resetn] [get_bd_pins host_ram_to_rdmx/resetn]
connect_bd_net -net dst_address_1 [get_bd_pins control/xmit_dst_addr] [get_bd_pins host_ram_to_rdmx/dst_address]
connect_bd_net [get_bd_pins packet_buffer/bad_packet_strb] [get_bd_pins control/bad_packet_strb]
connect_bd_net [get_bd_pins packet_buffer/good_packet_strb] [get_bd_pins control/good_packet_strb]
connect_bd_net [get_bd_pins packet_buffer/hbm_cattrip] [get_bd_pins hbm_cattrip] [get_bd_pins control/async_hbm_cattrip]
connect_bd_net [get_bd_pins packet_buffer/hbm_temp] [get_bd_pins control/async_hbm_temp]
connect_bd_net [get_bd_pins packet_buffer/hwm_0] [get_bd_pins control/hwm_0]
connect_bd_net [get_bd_pins packet_buffer/hwm_1] [get_bd_pins control/hwm_1]
connect_bd_net [get_bd_pins packet_buffer/overflow_0] [get_bd_pins control/overflow_0]
connect_bd_net [get_bd_pins packet_buffer/overflow_1] [get_bd_pins control/overflow_1]
connect_bd_net -net pause_pci_1 [get_bd_pins control/pause_pci] [get_bd_pins pause_pci]
connect_bd_net -net pci_base_1 [get_bd_pins control/pci_base] [get_bd_pins pci_base]
connect_bd_net -net pci_size_1 [get_bd_pins control/pci_size] [get_bd_pins pci_size]
connect_bd_net [get_bd_pins pci_throughput] [get_bd_pins control/pci_throughput]
connect_bd_net -net pcie_bridge_axi_aclk [get_bd_pins clk] \
  [get_bd_pins packet_buffer/clk] [get_bd_pins qsfp/clk] [get_bd_pins host_ram_to_rdmx/clk] [get_bd_pins control/clk]
connect_bd_net -net pcie_bridge_axi_aresetn [get_bd_pins resetn] [get_bd_pins control/resetn]
connect_bd_net -net pcie_bridge_pci_range_err_strb [get_bd_pins pci_range_err_strb] [get_bd_pins control/pci_range_err_strb]
connect_bd_net [get_bd_pins qsfp/gen_idle] [get_bd_pins control/generator_idle]
connect_bd_net [get_bd_pins qsfp/rx_aligned] [get_bd_pins control/async_pcs_aligned]
connect_bd_net [get_bd_pins qsfp/sender_port] [get_bd_pins control/sender_port]
connect_bd_net [get_bd_pins qsfp/status_leds] [get_bd_pins status_leds]
connect_bd_net -net src_address_1 [get_bd_pins control/xmit_src_addr] [get_bd_pins host_ram_to_rdmx/src_address]
connect_bd_net -net start_1 [get_bd_pins control/xmit_start] [get_bd_pins host_ram_to_rdmx/start]
